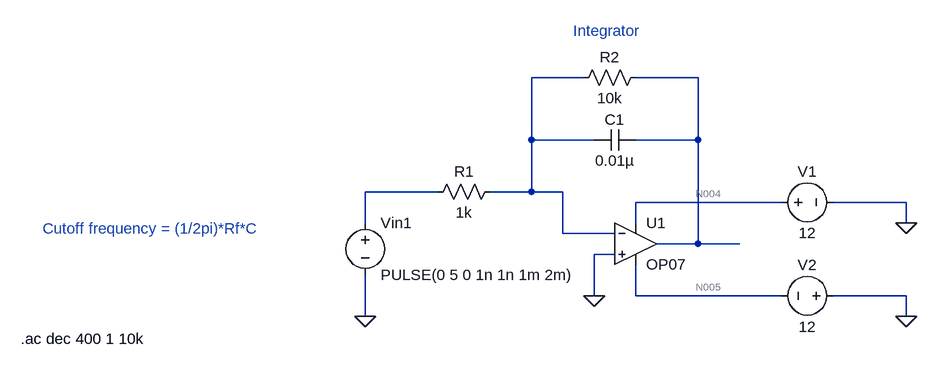
[diagram p0: schematic Integrator.asc]
Integrator.asc, the LTspice schematic file:
Version 4
SHEET 1 880 680
WIRE 32 -112 -48 -112
WIRE 208 -112 112 -112
WIRE -48 -16 -48 -112
WIRE 48 -16 -48 -16
WIRE 208 -16 208 -112
WIRE 208 -16 112 -16
WIRE -192 64 -304 64
WIRE -48 64 -48 -16
WIRE -48 64 -112 64
WIRE 0 64 -48 64
WIRE 336 80 112 80
WIRE 528 80 416 80
WIRE -304 112 -304 64
WIRE 112 112 112 80
WIRE 528 112 528 80
WIRE 0 128 0 64
WIRE 80 128 0 128
WIRE 208 144 208 -16
WIRE 208 144 144 144
WIRE 272 144 208 144
WIRE 80 160 48 160
WIRE 48 224 48 160
WIRE 112 224 112 176
WIRE 336 224 112 224
WIRE 528 224 416 224
WIRE -304 256 -304 192
WIRE 528 256 528 224
FLAG 528 112 0
FLAG 528 256 0
FLAG 48 224 0
FLAG -304 256 0
SYMBOL voltage -304 96 R0
WINDOW 123 0 0 Left 0
WINDOW 39 0 0 Left 0
SYMATTR InstName Vin1
SYMATTR Value PULSE(0 5 0 1n 1n 1m 2m)
SYMBOL voltage 320 80 R270
WINDOW 0 32 56 VTop 2
WINDOW 3 -32 56 VBottom 2
WINDOW 123 0 0 Left 0
WINDOW 39 0 0 Left 0
SYMATTR InstName V1
SYMATTR Value 12
SYMBOL voltage 432 224 R90
WINDOW 0 -32 56 VBottom 2
WINDOW 3 32 56 VTop 2
WINDOW 123 0 0 Left 0
WINDOW 39 0 0 Left 0
SYMATTR InstName V2
SYMATTR Value 12
SYMBOL OpAmps\\OP07 112 80 R0
SYMATTR InstName U1
SYMBOL res -208 80 R270
WINDOW 0 32 56 VTop 2
WINDOW 3 0 56 VBottom 2
SYMATTR InstName R1
SYMATTR Value 1k
SYMBOL cap 112 -32 R90
WINDOW 0 0 32 VBottom 2
WINDOW 3 32 32 VTop 2
SYMATTR InstName C1
SYMATTR Value 0.01µ
SYMBOL res 128 -128 R90
WINDOW 0 0 56 VBottom 2
WINDOW 3 32 56 VTop 2
SYMATTR InstName R2
SYMATTR Value 10k
TEXT 16 -184 Left 2 ;Integrator
TEXT -834 290 Left 2 !.ac dec 400 1 10k
TEXT -800 120 Left 2 ;Cutoff frequency = (1/2pi)*Rf*C

The netlist it stands for:
* Integrator.asc
Vin1 N003 0 PULSE(0 5 0 1n 1n 1m 2m)
V1 N004 0 12
V2 0 N005 12
XU1 0 N001 N004 N005 N002 LT1001  ; OP07, pins In+ In- V+ V- OUT
R1 N003 N001 1k
C1 N002 N001 0.01µ
R2 N002 N001 10k
* Integrator
.ac dec 400 1 10k
* Cutoff frequency = (1/2pi)*Rf*C
.lib LTC.lib
.backanno
.end

* Results of the author's LTspice run, read from the files saved beside the schematic
* Operating Point, zero values left out:
*   V(n004) = 12 V
*   V(n005) = -12 V
*   I(V1) = -2.25 mA
*   I(V2) = -2.25 mA
*   Ix(u1:3) = 2.25 mA
*   Ix(u1:4) = -2.25 mA